# EAGLE design M0_Express_eh_shield (EAGLE 9.1.3)
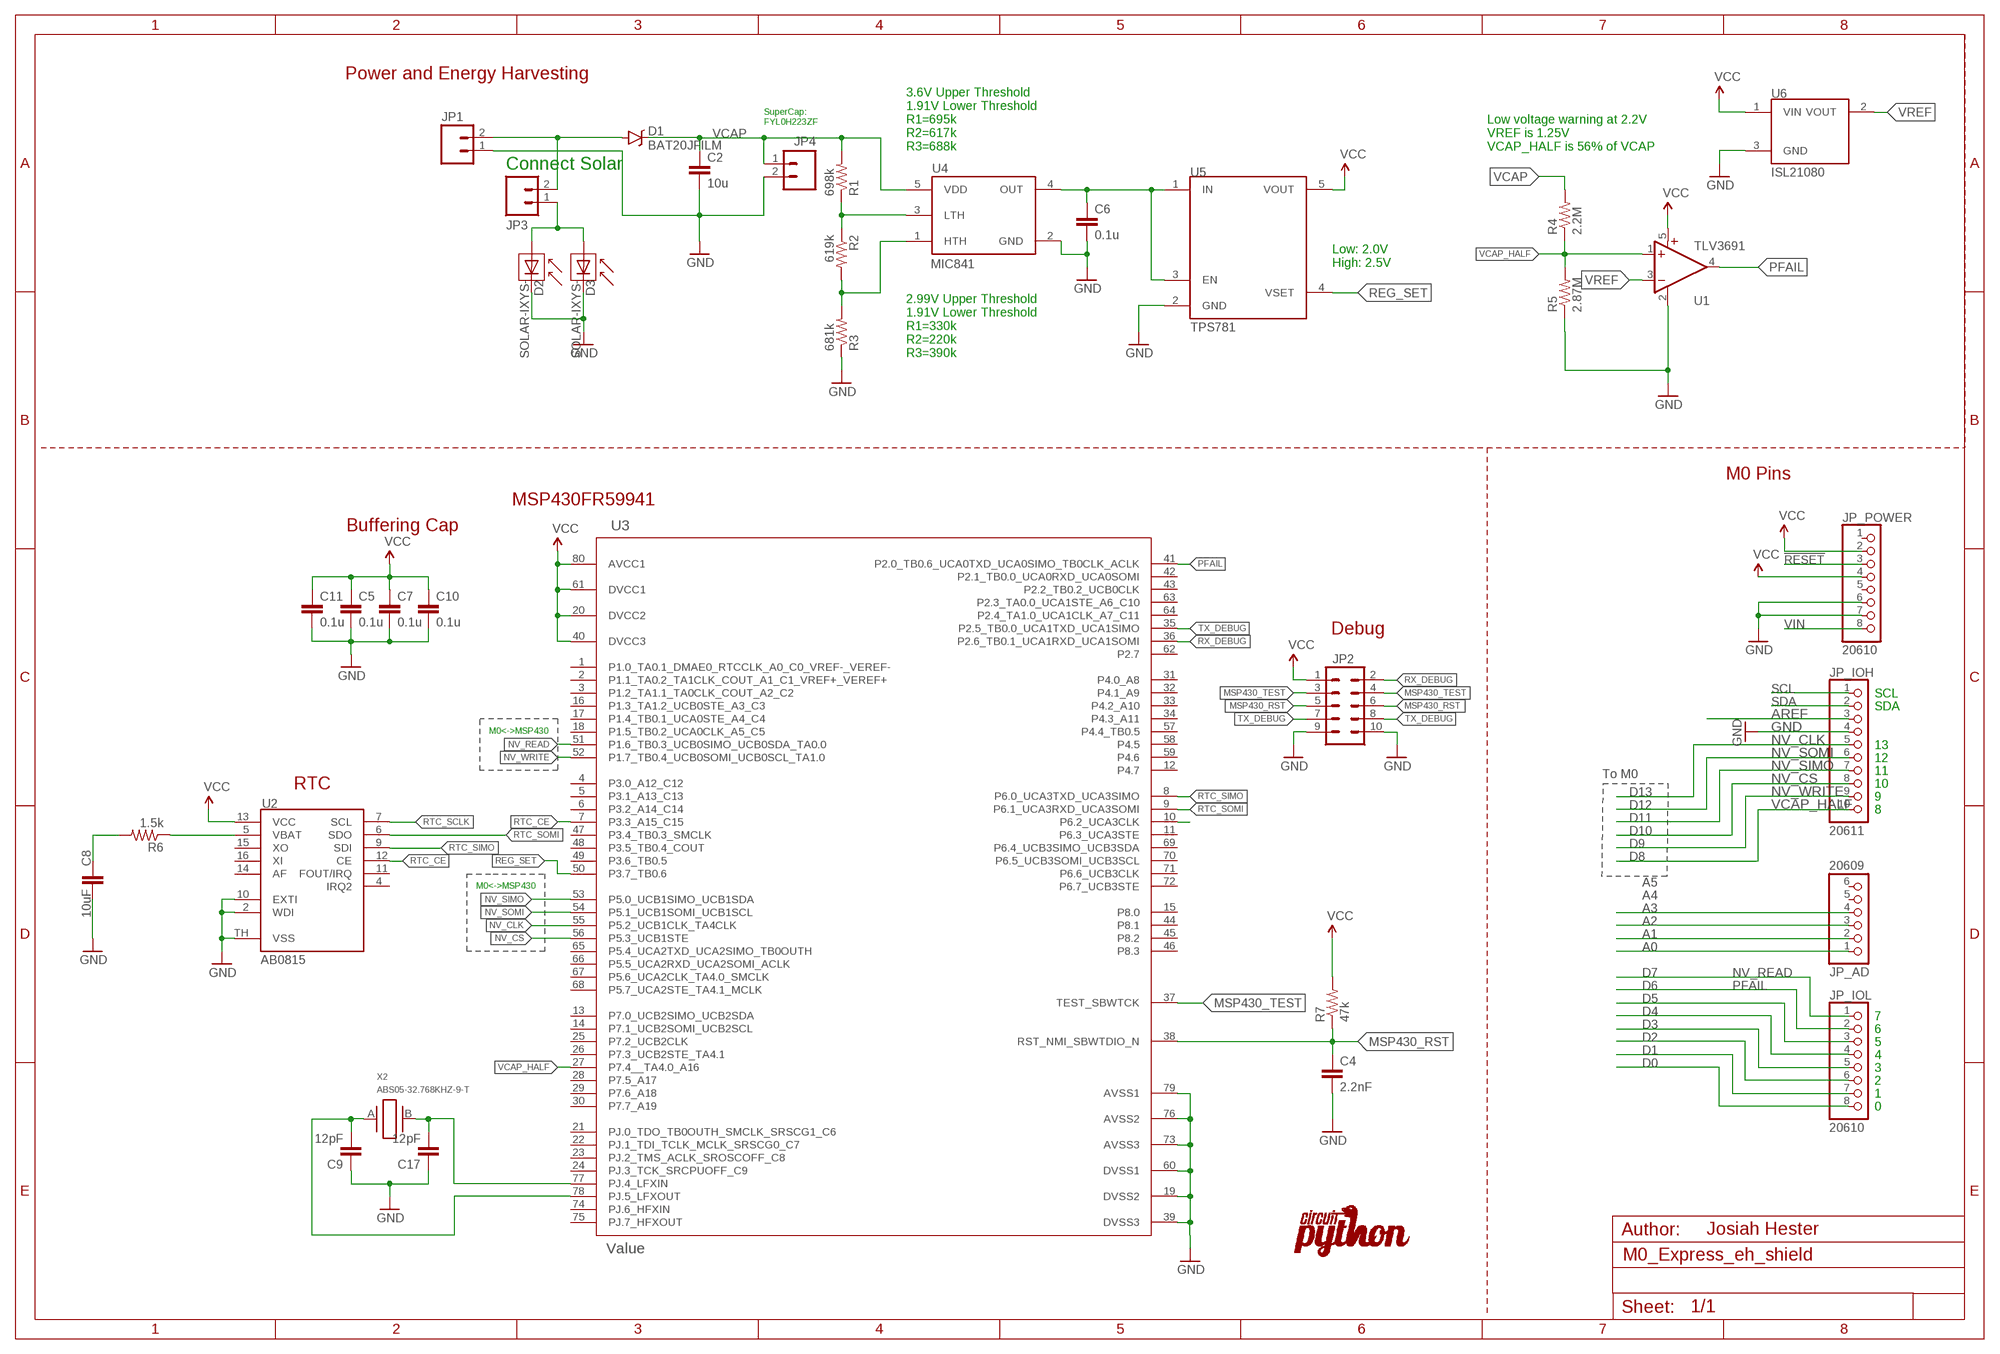
[diagram p0: schematic, sheet 1]

## Parts
C2  10u  CAP0805  [0805]
C4  2.2nF  C-EU0603  [0603]
C5  0.1u  C-EU0603  [0603]
C6  0.1u  C-EU0603  [0603]
C7  0.1u  C-EU0603  [0603]
C8  10uF  CAP0805  [0805]
C9  12pF  C-EU0603  [0603]
C10  0.1u  C-EU0603  [0603]
C11  0.1u  C-EU0603  [0603]
C17  12pF  C-EU0603  [0603]
D1  BAT20JFILM  [SOD-323]
D2  SOLAR-IXYS-  [SOLARBIT-12X1]
D3  SOLAR-IXYS-  [SOLARBIT-12X1]
JP1  M02LOCK  [1X02_LOCK]
JP2  M05X21.27MM  [2X5_1.27MM]
JP3  M02LOCK  [1X02_LOCK]
JP4  M025MM  [SCREWTERMINAL-5MM-2]
JP_AD  20609  HEADER-1X6OVALWAVE  [1X06_OVALWAVE]
JP_IOH  20611  HEADER-1X10OVALWAVE  [1X10_OVALWAVE]
JP_IOL  20610  HEADER-1X8OVALWAVE  [1X08_OVALWAVE]
JP_POWER  20610  HEADER-1X8OVALWAVE  [1X08_OVALWAVE]
R1  698k  R-EU0603  [0603]
R2  619k  R-EU0603  [0603]
R3  681k  R-EU0603  [0603]
R4  2.2M  R-EU0603  [0603]
R5  2.87M  R-EU0603  [0603]
R6  1.5k  R-EU0603  [0603]
R7  47k  R-EU0603  [0603]
U1  TLV3691  [SC70-5]
U2  AB0815  [QFN16]
U3  Value  MSP430FR5994IPNR  [PN0080A_N]
U4  MIC841  [SC70-5]
U5  TPS781  [DCK_R-PDSO-G5]
U6  ISL21080  [SOT-23]
U$1  LOGO  [CIRCUITPYTHON-LOGO]
X2  ABS05-32.768KHZ-9-T  [ABS05]

## Nets
!RESET: JP_POWER.3
A0: JP_AD.1
A1: JP_AD.2
A2: JP_AD.3
A3: JP_AD.4
AREF [aref]: JP_IOH.3
D0: JP_IOL.8
D1: JP_IOL.7
D2: JP_IOL.6
D3: JP_IOL.5
D4: JP_IOL.4
D5: JP_IOL.3
GND [gnd]: C2.2 C4.2 C5.2 C6.2 C7.2 C8.2 C9.1 C10.2 C11.2 C17.1 D2.-(C) D3.-(C) JP1.1 JP2.9 JP2.10 JP4.2 JP_IOH.4 JP_POWER.6 JP_POWER.7 R3.1 R5.1 U1.2(GND) U2.2(WDI) U2.10(EXTI) U2.TH(VSS) U3.19(DVSS2) U3.39(DVSS3) U3.60(DVSS1) U3.73(AVSS3) U3.76(AVSS2) U3.79(AVSS1) U4.2(GND) U5.2(GND) U6.3(GND)
MSP430_RST: C4.1 JP2.5 JP2.6 R7.1 U3.38(RST_NMI_SBWTDIO_N)
MSP430_TEST: JP2.3 JP2.4 U3.37(TEST_SBWTCK)
N$1: D1.A JP1.2 JP3.2
N$2: R1.1 R2.1 U4.3(LTH)
N$3: R2.2 R3.2 U4.1(HTH)
N$4: R6.1 U2.5(VBAT)
N$5: C17.2 U3.77(PJ.4_LFXIN) X2.B
N$6: C9.2 U3.78(PJ.5_LFXOUT) X2.A
N$7: C6.1 U4.4(OUT) U5.1(IN) U5.3(EN)
N$8: C8.1 R6.2
N$10: D2.+(A) D3.+(A) JP3.1
NV_CLK: JP_IOH.5 U3.55(P5.2_UCB1CLK_TA4CLK)
NV_CS: JP_IOH.8 U3.56(P5.3_UCB1STE)
NV_READ: JP_IOL.1 U3.51(P1.6_TB0.3_UCB0SIMO_UCB0SDA_TA0.0)
NV_SIMO: JP_IOH.7 U3.53(P5.0_UCB1SIMO_UCB1SDA)
NV_SOMI: JP_IOH.6 U3.54(P5.1_UCB1SOMI_UCB1SCL)
NV_WRITE: JP_IOH.9 U3.52(P1.7_TB0.4_UCB0SOMI_UCB0SCL_TA1.0)
PFAIL: JP_IOL.2 U1.4(OUT) U3.41(P2.0_TB0.6_UCA0TXD_UCA0SIMO_TB0CLK_ACLK)
REG_SET: U3.50(P3.7_TB0.6) U5.4(VSET)
RTC_CE: U2.12(CE) U3.7(P3.3_A15_C15)
RTC_SCLK: U2.7(SCL) U3.10(P6.2_UCA3CLK)
RTC_SIMO: U2.9(SDI) U3.8(P6.0_UCA3TXD_UCA3SIMO)
RTC_SOMI: U2.6(SDO) U3.9(P6.1_UCA3RXD_UCA3SOMI)
RX_DEBUG: JP2.2 U3.36(P2.6_TB0.1_UCA1RXD_UCA1SOMI)
SCL: JP_IOH.1
SDA: JP_IOH.2
TX_DEBUG: JP2.7 JP2.8 U3.35(P2.5_TB0.0_UCA1TXD_UCA1SIMO)
VCAP: C2.1 D1.C JP4.1 R1.2 R4.2 U4.5(VDD)
VCAP_HALF: JP_IOH.10 R4.1 R5.2 U1.1(+IN) U3.27(P7.4__TA4.0_A16)
VCC: C5.1 C7.1 C10.1 C11.1 JP2.1 JP_POWER.2 JP_POWER.4 R7.2 U1.5(V+) U2.13(VCC) U3.20(DVCC2) U3.40(DVCC3) U3.61(DVCC1) U3.80(AVCC1) U5.5(VOUT) U6.1(VIN)
VIN [USB]: JP_POWER.8
VREF: U1.3(-IN) U6.2(VOUT)
Unconnected: JP_AD.5 JP_AD.6 JP_POWER.1 JP_POWER.5 U2.4(IRQ2) U2.11(FOUT/IRQ) U2.14(AF) U2.15(XO) U2.16(XI) U3.1(P1.0_TA0.1_DMAE0_RTCCLK_A0_C0_VREF-_VEREF-) U3.2(P1.1_TA0.2_TA1CLK_COUT_A1_C1_VREF+_VEREF+) U3.3(P1.2_TA1.1_TA0CLK_COUT_A2_C2) U3.4(P3.0_A12_C12) U3.5(P3.1_A13_C13) U3.6(P3.2_A14_C14) U3.11(P6.3_UCA3STE) U3.12(P4.7) U3.13(P7.0_UCB2SIMO_UCB2SDA) U3.14(P7.1_UCB2SOMI_UCB2SCL) U3.15(P8.0) U3.16(P1.3_TA1.2_UCB0STE_A3_C3) U3.17(P1.4_TB0.1_UCA0STE_A4_C4) U3.18(P1.5_TB0.2_UCA0CLK_A5_C5) U3.21(PJ.0_TDO_TB0OUTH_SMCLK_SRSCG1_C6) U3.22(PJ.1_TDI_TCLK_MCLK_SRSCG0_C7) U3.23(PJ.2_TMS_ACLK_SROSCOFF_C8) U3.24(PJ.3_TCK_SRCPUOFF_C9) U3.25(P7.2_UCB2CLK) U3.26(P7.3_UCB2STE_TA4.1) U3.28(P7.5_A17) U3.29(P7.6_A18) U3.30(P7.7_A19) U3.31(P4.0_A8) U3.32(P4.1_A9) U3.33(P4.2_A10) U3.34(P4.3_A11) U3.42(P2.1_TB0.0_UCA0RXD_UCA0SOMI) U3.43(P2.2_TB0.2_UCB0CLK) U3.44(P8.1) U3.45(P8.2) U3.46(P8.3) U3.47(P3.4_TB0.3_SMCLK) U3.48(P3.5_TB0.4_COUT) U3.49(P3.6_TB0.5) U3.57(P4.4_TB0.5) U3.58(P4.5) U3.59(P4.6) U3.62(P2.7) U3.63(P2.3_TA0.0_UCA1STE_A6_C10) U3.64(P2.4_TA1.0_UCA1CLK_A7_C11) U3.65(P5.4_UCA2TXD_UCA2SIMO_TB0OUTH) U3.66(P5.5_UCA2RXD_UCA2SOMI_ACLK) U3.67(P5.6_UCA2CLK_TA4.0_SMCLK) U3.68(P5.7_UCA2STE_TA4.1_MCLK) U3.69(P6.4_UCB3SIMO_UCB3SDA) U3.70(P6.5_UCB3SOMI_UCB3SCL) U3.71(P6.6_UCB3CLK) U3.72(P6.7_UCB3STE) U3.74(PJ.6_HFXIN) U3.75(PJ.7_HFXOUT)

## Notes on the sheet
- Power and Energy Harvesting
- SuperCap:
  FYL0H223ZF
- 3.6V Upper Threshold
  1.91V Lower Threshold
  R1=695k
  R2=617k
  R3=688k
- Low voltage warning at 2.2V
  VREF is 1.25V
  VCAP_HALF is 56% of VCAP
- Connect Solar
- Low: 2.0V
  High: 2.5V
- 2.99V Upper Threshold
  1.91V Lower Threshold
  R1=330k
  R2=220k
  R3=390k
- M0 Pins
- MSP430FR59941
- Buffering Cap
- Debug
- SCL
- SDA
- M0<->MSP430
- 13
- 12
- 11
- To M0
- RTC | 10
- D13 | 9
- D12 | 8
- D11
- D10
- D9
- D8
- A5
- M0<->MSP430
- A4
- D7
- D6
- 7
- 6
- 5
- 4
- 3
- 2
- 1
- 0
- Josiah Hester

## Library data of the parts
C2 C8 = SparkFun-Capacitors:CAP: Capacitor Standard 0603 ceramic capacitor, and 0.1" leaded capacitor.; DIGIKEY: 1276-6456-1-ND
C4 = tiny_passives:C-EU; DIGIKEY: 478-1219-1-ND; MPN: 06035C222KAT2A
C5-C7 C10 C11 = tiny_passives:C-EU; DIGIKEY: 1276-1005-1-ND; MPN: CL10B104KO8NNNC
C9 C17 = tiny_passives:C-EU; DIGIKEY: 1276-1254-1-ND; MPN: CL10C120JB8NNNC
D1 = SparkFun-DiscreteSemi:BAT20JFILM: 23V, 1A Schottky diode, SOD-323 package; DIGIKEY: NSR0530HT1GOSCT-ND; PROD_ID: DIO-11623
D2 D3 = SparkFun-Sensors:SOLAR-IXYS; DIGIKEY: KXOB25-02X8F-ND; MPN: KXOB25-02X8F
JP1 JP3 = SparkFun-Connectors:M02: Standard 2-pin 0.1" header. Use with - straight break away headers ( PRT-00116) - right angle break away headers (PRT-00553) - swiss pins (PRT-00743) - machine pins (PRT-00117) - female headers (PRT-00115) Molex polarized connector foot print use with: PRT-08233 with associated crimp pins and housings. 2.54_SCREWTERM for use with PRT-10571. 3.5mm Screw Terminal footprints for PRT-08084 5mm Screw Terminal footprints for use with PRT-08432
JP2 = SparkFun-Connectors:M05X2: Header 5x2 Standard 10-pin dual row 0.1" header. Commonly used with AVR-ISP. Use with Spark Fun Electronics SKU: PRT-00778; DIGIKEY: 1175-1627-ND; MPN: 3220-10-0100-00
JP4 = SparkFun-Connectors:M02: Standard 2-pin 0.1" header. Use with - straight break away headers ( PRT-00116) - right angle break away headers (PRT-00553) - swiss pins (PRT-00743) - machine pins (PRT-00117) - female headers (PRT-00115) Molex polarized connector foot print use with: PRT-08233 with associated crimp pins and housings. 2.54_SCREWTERM for use with PRT-10571. 3.5mm Screw Terminal footprints for PRT-08084 5mm Screw Terminal footprints for use with PRT-08432; STOREFRONT_ID: PRT-08432
JP_AD = microbuilder:HEADER-1X6: PIN HEADER
JP_IOH = microbuilder:HEADER-1X10: PIN HEADER
JP_IOL JP_POWER = microbuilder:HEADER-1X8: PIN HEADER
R1 = tiny_passives:R-EU; DIGIKEY: 311-698KHRCT-ND; MPN: RC0603FR-07698KL
R2 = tiny_passives:R-EU; DIGIKEY: 311-619KHRCT-ND; MPN: RC0603FR-07619KL
R3 = tiny_passives:R-EU; DIGIKEY: RMCF0603FT681KCT-ND; MPN: RMCF0603FT681K
R4 = tiny_passives:R-EU; DIGIKEY: YAG3329CT-ND; MPN: RC0603FR-072M2L
R5 = tiny_passives:R-EU; DIGIKEY: RMCF0603FT2M87CT-ND; MPN: RMCF0603FT2M87
R6 = tiny_passives:R-EU; DIGIKEY: A121524CT-ND; MPN: CRG0603F1K5
R7 = tiny_passives:R-EU; DIGIKEY: 541-4061-1-ND; MPN: CRCW060347K0JNEAC
U1 = tlv3691:TLV3691: 0.9-V to 6.5-V, Nanopower Comparator Datasheets Analog Signal Chain Guide <http://www.ti.com/lit/pdf/slyb174> TLV3691 <http://www.ti.com/lit/ds/symlink/tlv3691.pdf> Manufacturer Product Page TLV3691IDPFR Specifications <http://www.ti.com/general/docs/suppproductinfo.tsp?distId=10&orderablePartNumber=TLV3691IDPFR> Standard Package <javascript:dlgHelp('Standard%20Packaging%20Help');> 1 Category Integrated Circuits (ICs) </product-search/en/integrated-circuits-ics> Family Linear - Comparators </product-search/en/integrated-circuits-ics/linear-comparators/2556221> Series - Packaging <javascript:dlgHelp('Standard%20Packaging%20Help');> Cut Tape (CT) <javascript:dlgHelp('Cut%20Tape%20Help');> Type General Purpose Number of Elements 1 Output Type Push-Pull Voltage - Supply, Single/Dual (±) 0.9 V ~ 6.5 V, ±0.45 V ~ 3.25 V Voltage - Input Offset (Max) 3mV Current - Input Bias (Max) 100pA Current - Output (Typ) 42mA Current - Quiescent (Max) 150nA CMRR, PSRR (Typ) - Propagation Delay (Max) 35µs Hysteresis - Operating Temperature -40°C ~ 125°C Package / Case 6-XFDFN Mounting Type Surface Mount Supplier Device Package 6-X2SON (1x1) Online Catalog Comparators - 1 element </catalog/en/partgroup/comparators-1-element/3112?mpart=TLV3691IDPFR&vendor=296&WT.z_ref_page_type=PS&WT.z_ref_page_sub_type=PD&WT.z_ref_page_id=PD&WT.z_ref_page_event=DC_Link_Table> Other Names 296-37242-1; DIGIKEY: 296-37910-1-ND; MPN: TLV3691IDCKR
U2 = AB08XX:AB0815: AB08X5 Real-Time Clock Family: SPI The ABRACON AB08X5 Real-Time Clock family provides a groundbreaking combination of ultra-low power coupled with a highly sophisticated feature set. With power requirements significantly lower than any other industry RTC (as low as 14 nA), these are the first semiconductors based on innovative SPOTTM (Subthreshold Power Optimized Technology) CMOS platform. The AB08X5 includes on-chip oscillators to provide minimum power consumption, full RTC functions including battery backup and programmable counters and alarms for timer and watchdog functions, and either an I2C or SPI serial interface for communication with a host controller.; DIGIKEY: 535-11930-1-ND; MPN: AB0815-T3
U3 = msp430fr5994:MSP430FR5994IPNR; DIGIKEY: 296-45561-1-ND; MANUFACTURER: Texas Instruments; PARTNUMBER: MSP430FR5994IPNR; REFDES: RefDes; TYPE: TYPE
U4 = fedpower:MIC841: MIC841:Comparator with reference and adj. hysteresis; DIGIKEY: 576-2923-1-ND; MPN: MIC841HYC5-TR
U5 = ti-regulator:TPS781: Texas Instruments: TPS781 150mA, Low-Dropout Regulator, Ultralow-Power, IQ 1µA with Pin-Selectable, Dual-Level Output Voltage; DIGIKEY: 296-29966-1-ND
U6 = isl21080:ISL21080: Intersil: ISL21080, 300nA NanoPower Voltage References The ISL21080 analog voltage references feature low supply voltage operation at ultra-low 310nA typ, 1.5µA max operating current. Additionally, the ISL21080 family features guaranteed initial accuracy as low as ±0.2% and 50ppm/°C temperature coefficient. These references are ideal for general purpose portable applications to extend battery life at lower cost. The ISL21080 is provided in the industry standard 3 Ld SOT-23 pinout. The ISL21080 output voltages can be used as precision voltage sources for voltage monitors, control loops, standby voltages for low power states for DSP, FPGA, Datapath Controllers, microcontrollers and other core voltages: 0.9V, 1.024V, 1.25V, 1.5V, 2.048V, 2.5V, 3.0V, 3.3V, 4.096V and 5.0V. Special Note: Post-assembly x-ray inspection may lead to permanent changes in device output voltage and should be minimized or avoided. For further information, please see “Applications Information” on page 14 and AN1533, “X-Ray Effects on Intersil FGA References”.; DIGIKEY: ISL21080DIH312Z-TKTR-ND; MPN: ISL21080DIH312Z-TK
U$1 = circuitpython-logo:LOGO
X2 = abs05:ABS05-32.768KHZ: 32.768kHz Crystal; DIGIKEY: 535-11897-1-ND; MPN: ABS05-32.768KHZ-9-T

## Net classes
0 default: width 0.33 mm, drill 0.33 mm, clearance 0.152 mm

## Board
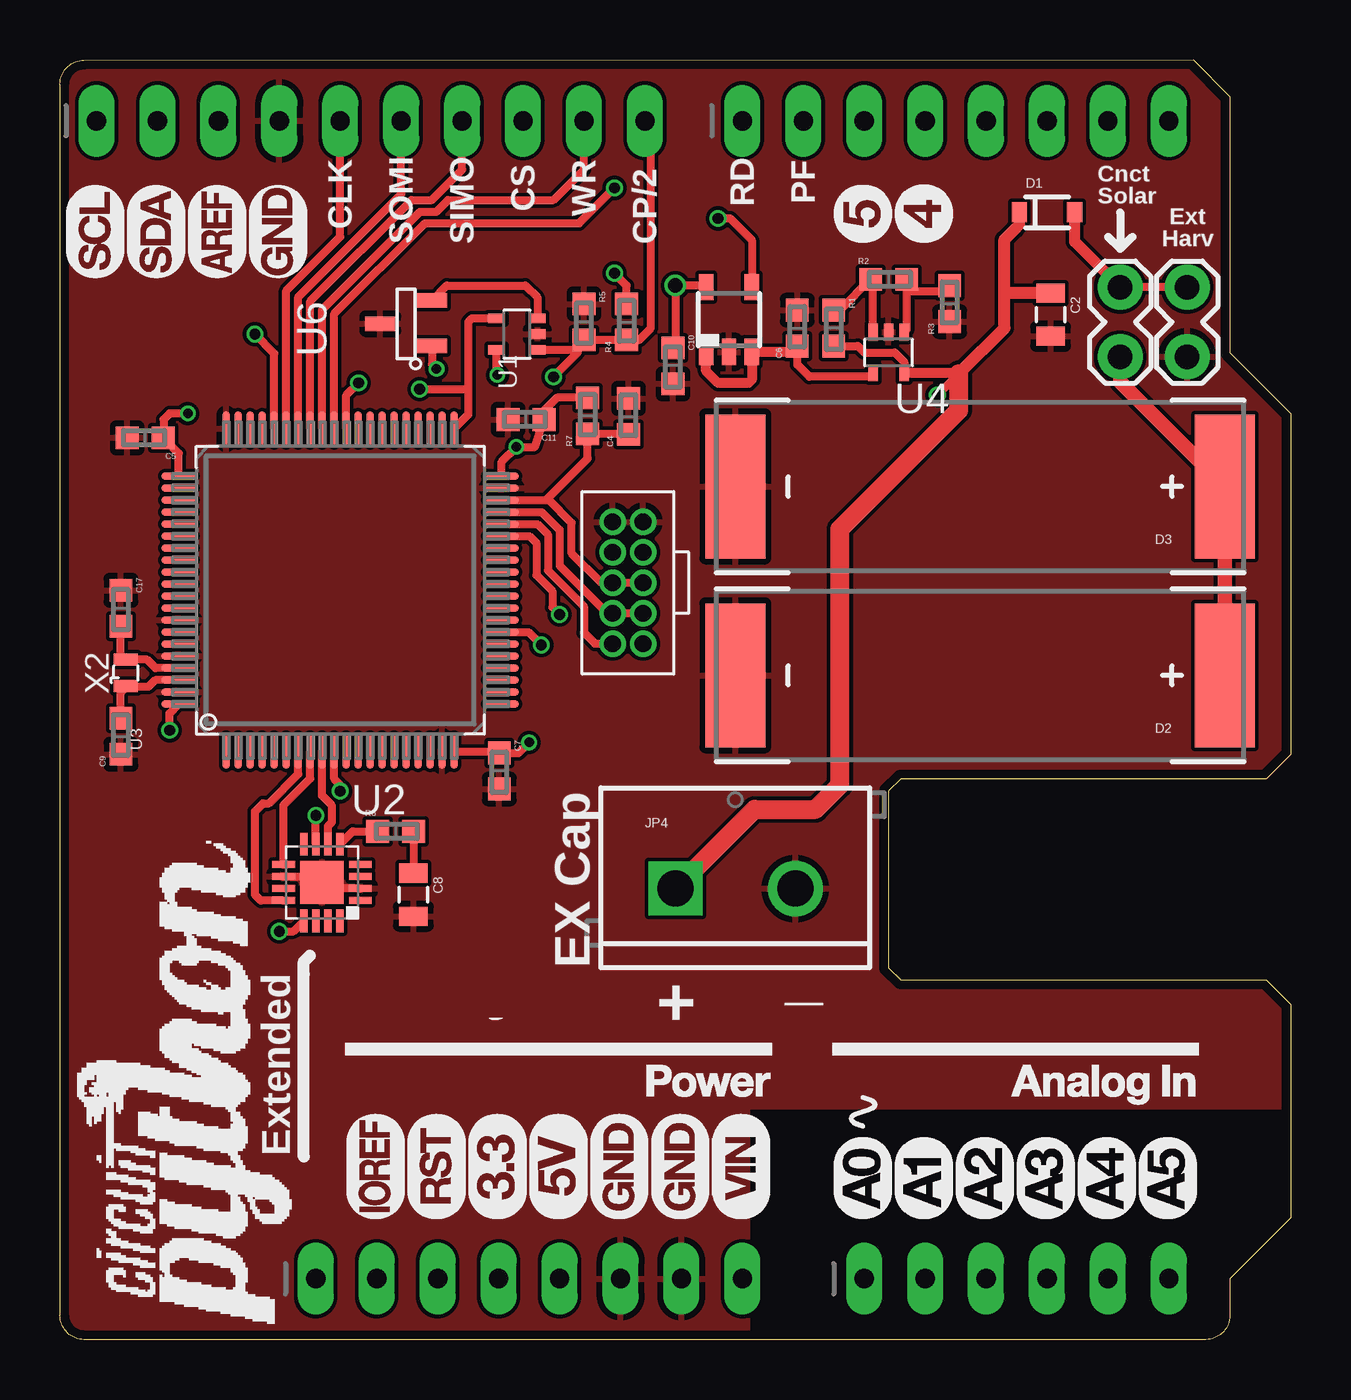
[diagram p1: board, top side]
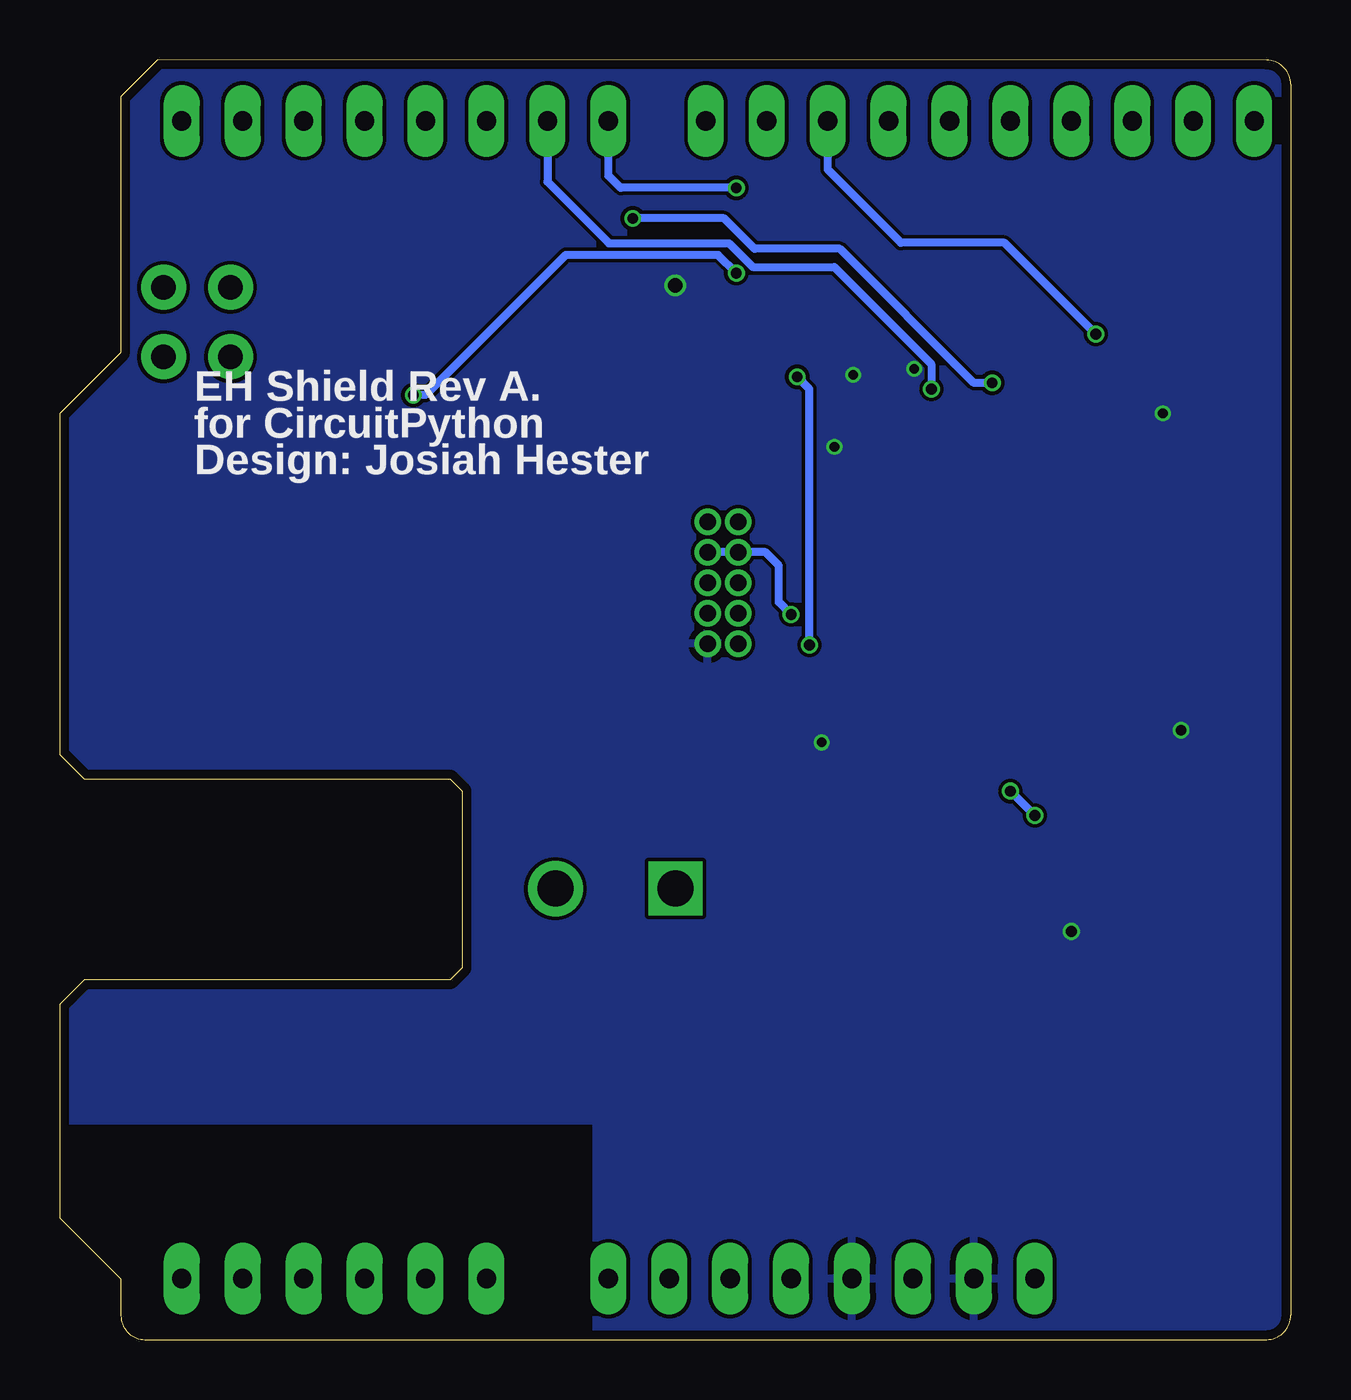
[diagram p2: board, bottom side, seen from below]

Size 51.31 x 53.34 mm. Coordinates in mm from the lower left corner, seen from the top.
Outline: 47.24,53.34 48.77,51.82 48.77,41.15 51.31,38.61 51.31,24.38 50.29,23.37 35.05,23.37 34.54,22.86 34.54,15.75 34.54,15.49 35.05,14.99 50.04,14.99 50.29,14.99 51.31,13.97 51.31,13.72 51.31,5.08 48.77,2.54 48.77,1 arc-90 47.77,0 1,0 arc-90 0,1.02 0,52.32 arc-90 1,53.32 47.24,53.34
Copper layers (1*16): Top 0.035559375mm / dielectric 1.6mm / Bottom 0.035559375mm
Design rules "oshpark-2layer": minimum track width 6mil, minimum drill 10mil, track to track 6mil, track to pad 6mil, pad to pad 6mil, via to via 6mil, smd to smd 6mil, copper to edge 15mil, drill to drill 6mil, minimum pad ring 5mil, minimum via ring 5mil, stop-mask expansion 2.5mil, vias tented up to drill 0mil, thermal gap 10mil

### Footprints (pad centres in the part's own frame; a part is rotated, then mirrored left to right if it is on the bottom)
0805 = smd 0.8 x 1.2: 1 -0.9,0; 2 0.9,0
0603 = smd 0.95 x 0.95: 1 -0.75,0; 2 0.75,0
SOD-323 = smd 0.63 x 0.83: A 1.15,0; C -1.15,0
SOLARBIT-12X1 = smd 2.5 x 6: + -10.2,0; - 10.2,0
1X02_LOCK = drill 1.016 pad 1.88: 1 -0.178,0; 2 2.718,0
2X5_1.27MM = drill 0.7 pad 1.1: 1 0,0; 2 1.27,0; 3 0,-1.27; 4 1.27,-1.27; 5 0,-2.54; 6 1.27,-2.54; 7 0,-3.81; 8 1.27,-3.81; 9 0,-5.08; 10 1.27,-5.08
SCREWTERMINAL-5MM-2 = drill 1.5 pad 2.232 square: 1 0,0 | drill 1.5 pad 2.3: 2 5,0
1X06_OVALWAVE = drill 0.8 pad 1.5 long: 1 -6.35,0; 2 -3.81,0; 3 -1.27,0; 4 1.27,0; 5 3.81,0; 6 6.35,0
1X10_OVALWAVE = drill 0.8 pad 1.5 long: 1 -11.43,0; 2 -8.89,0; 3 -6.35,0; 4 -3.81,0; 5 -1.27,0; 6 1.27,0; 7 3.81,0; 8 6.35,0; 9 8.89,0; 10 11.43,0
1X08_OVALWAVE = drill 0.8 pad 1.5 long: 1 -8.89,0; 2 -6.35,0; 3 -3.81,0; 4 -1.27,0; 5 1.27,0; 6 3.81,0; 7 6.35,0; 8 8.89,0
SC70-5 = smd 0.4 x 0.7: 1 -0.65,-0.85; 2 0,-0.85; 3 0.65,-0.85; 4 0.65,0.85; 5 -0.65,0.85
QFN16 = smd 0.95 x 0.3: 1 -1.6,0.75; 2 -1.6,0.25; 3 -1.6,-0.25; 4 -1.6,-0.75; 9 1.6,-0.75; 10 1.6,-0.25; 11 1.6,0.25; 12 1.6,0.75 | smd 0.3 x 0.95: 5 -0.75,-1.6; 6 -0.25,-1.6; 7 0.25,-1.6; 8 0.75,-1.6; 13 0.75,1.6; 14 0.25,1.6; 15 -0.25,1.6; 16 -0.75,1.6 | smd 1.8 x 1.8: TH 0,0
PN0080A_N = smd 1.448 x 0.305: 1 -6.725,4.75; 2 -6.725,4.25; 3 -6.725,3.75; 4 -6.725,3.25; 5 -6.725,2.75; 6 -6.725,2.25; 7 -6.725,1.75; 8 -6.725,1.25; 9 -6.725,0.75; 10 -6.725,0.25; 11 -6.725,-0.25; 12 -6.725,-0.75; 13 -6.725,-1.25; 14 -6.725,-1.75; 15 -6.725,-2.25; 16 -6.725,-2.75; 17 -6.725,-3.25; 18 -6.725,-3.75; 19 -6.725,-4.25; 20 -6.725,-4.75; 41 6.725,-4.75; 42 6.725,-4.25; 43 6.725,-3.75; 44 6.725,-3.25; 45 6.725,-2.75; 46 6.725,-2.25; 47 6.725,-1.75; 48 6.725,-1.25; 49 6.725,-0.75; 50 6.725,-0.25; 51 6.725,0.25; 52 6.725,0.75; 53 6.725,1.25; 54 6.725,1.75; 55 6.725,2.25; 56 6.725,2.75; 57 6.725,3.25; 58 6.725,3.75; 59 6.725,4.25; 60 6.725,4.75 | smd 0.305 x 1.448: 21 -4.75,-6.725; 22 -4.25,-6.725; 23 -3.75,-6.725; 24 -3.25,-6.725; 25 -2.75,-6.725; 26 -2.25,-6.725; 27 -1.75,-6.725; 28 -1.25,-6.725; 29 -0.75,-6.725; 30 -0.25,-6.725; 31 0.25,-6.725; 32 0.75,-6.725; 33 1.25,-6.725; 34 1.75,-6.725; 35 2.25,-6.725; 36 2.75,-6.725; 37 3.25,-6.725; 38 3.75,-6.725; 39 4.25,-6.725; 40 4.75,-6.725; 61 4.75,6.725; 62 4.25,6.725; 63 3.75,6.725; 64 3.25,6.725; 65 2.75,6.725; 66 2.25,6.725; 67 1.75,6.725; 68 1.25,6.725; 69 0.75,6.725; 70 0.25,6.725; 71 -0.25,6.725; 72 -0.75,6.725; 73 -1.25,6.725; 74 -1.75,6.725; 75 -2.25,6.725; 76 -2.75,6.725; 77 -3.25,6.725; 78 -3.75,6.725; 79 -4.25,6.725; 80 -4.75,6.725
DCK_R-PDSO-G5 = smd 0.6 x 1.1: 1 -0.95,-1.35; 2 0,-1.35; 3 0.95,-1.35; 4 0.95,1.35; 5 -0.95,1.35
SOT-23 = smd 0.6 x 1.25: 1 -0.95,-1.075; 2 0.95,-1.075; 3 -0.025,1.075
ABS05 = smd 0.5 x 1: A -0.55,0; B 0.55,0

### Placement (x,y rotation side)
C2  41.3,42.72 270 top
C4  23.7,38.48 90 top
C5  3.56,37.59 180 top
C6  30.73,42.16 90 top
C7  18.31,23.7 270 top
C8  14.73,18.54 270 top
C9  2.54,25.15 90 top
C10  25.55,40.59 270 top
C11  19.43,38.35 180 top
C17  2.54,30.48 270 top
D1  41.15,46.99 0 top
D2  38.35,27.69 180 top
D3  38.35,35.56 180 top
JP1  46.99,41.15 90 top
JP2  24.31,29.01 180 top
JP3  44.2,41.15 90 top
JP4  25.65,18.8 0 top
JP_AD  39.88,2.54 0 top
JP_IOH  12.95,50.8 0 top
JP_IOL  37.34,50.8 0 top
JP_POWER  19.56,2.54 0 top
R1  32.26,42.16 270 top
R2  34.54,44.2 0 top
R3  37.08,43.18 90 top
R4  23.62,42.42 90 top
R5  21.84,42.42 270 top
R6  14,21.18 0 top
R7  22,38.51 90 top
U1  19.05,41.91 90 top
U2  10.92,19.05 180 top
U3  11.68,31.24 90 top
U4  34.54,41.15 180 top
U5  27.89,42.52 0 top
U6  14.43,42.37 90 top
U$1  10.41,0.51 90 top
X2  2.74,27.79 90 top

### Tracks (layer width: path | path; a pad name or v marks a point on that pad's centre or on a via)
GND
  Top 0.33: U2.10 10.67,19.3 U2.TH 11.18,18.8 11.43,18.8 U2.2
  pour Top: -0.25,53.59 53.85,53.59 53.85,11.68 51.82,9.65 28.7,9.65 28.7,-0.76 -1.27,-0.76 -1.27,53.59
MSP430_RST
  Top 0.33: U3.38 20.26,34.99 | 20.26,34.99 22,36.73 R7.1 23.67,37.76 C4.1 | 20.26,34.99 20.38,34.99 21.34,34.04 21.34,32.77 22.55,31.55 JP2.6 JP2.5
MSP430_TEST
  Top 0.33: JP2.3 JP2.4 22.81,30.28 20.83,32.26 20.83,33.75 20.08,34.49 U3.37
N$1
  Top 0.33: JP1.2 JP3.2
  Top 0.45: JP3.2 42.3,45.76 D1.A
N$2
  Top 0.34: R1.1 32.51,42.91 R2.1 33.89,44.1 U4.3
N$3
  Top 0.34: R3.2 36.84,43.69 35.31,43.69 | U4.1 35.31,42.11 35.31,43.69 | 35.31,43.69 R2.2
N$4
  Top 0.33: U2.5 12.21,21.18 R6.1
N$5
  Top 0.33: U3.77 3.99,27.99 3.63,28.35 2.75,28.35 X2.B 2.54,28.54 C17.2
N$6
  Top 0.33: U3.78 3.97,27.49 3.68,27.2 2.78,27.2 | 2.78,27.2 X2.A | C9.2 2.54,26.97 2.78,27.2
N$7
  Top 0.33: U4.4 33.73,40.13 31.24,40.13 30.73,40.64 C6.1
  Top 0.406: C6.1 30.49,41.17 U5.3 28.84,40.02 28.7,39.88 27.43,39.88 26.94,40.37 U5.1
N$8
  Top 0.33: R6.2 14.73,21.17 C8.1
N$10
  Top 0.61: JP3.1 44.2,39.92 D3.+ D2.+
NV_CLK
  Top 0.33: U3.55 9.43,43.72 11.68,45.97 JP_IOH.5
NV_CS  (via drill 0.45)
  Top 0.33: U3.56 8.93,41.1 v8.13,41.91
  Bottom 0.33: v8.13,41.91 11.94,45.72 16.26,45.72 19.3,48.77 JP_IOH.8
NV_READ  (via drill 0.45)
  Top 0.33: U3.51 11.43,42.76 15.21,46.53 21.64,46.53 v23.11,48.01
  Bottom 0.33: v23.11,48.01 27.94,48.01 28.45,48.51 JP_IOL.1
NV_SIMO
  Top 0.33: U3.53 10.43,43.28 14.65,47.5 15.49,47.5 16.76,48.77 JP_IOH.7
NV_SOMI
  Top 0.33: U3.54 9.93,43.46 14.22,47.75 JP_IOH.6
NV_WRITE
  Top 0.33: U3.52 10.93,42.94 15.01,47.02 15.69,47.02 16.18,47.5 20.57,47.5 21.84,48.77 JP_IOH.9
PFAIL  (via drill 0.45)
  Top 0.33: U1.4 17.16,42.56 17.02,42.42 17.02,39.62 | U3.41 17.02,38.55 17.02,39.62 | v14.99,39.62 17.02,39.62
  Bottom 0.33: JP_IOL.2 30.99,48.26 28.42,45.7 23.41,45.7 22.42,44.7 19.03,44.7 14.99,40.66 v14.99,39.62
REG_SET  (via drill 0.45)
  Top 0.33: U3.50 11.93,39.37 v12.45,39.88 | v27.43,46.74 27.94,46.74 28.84,45.84 U5.4
  Bottom 0.33: v12.45,39.88 13.21,39.88 18.8,45.47 22.35,45.47 23.62,46.74 v27.43,46.74
RTC_CE
  Top 0.33: U2.12 8.37,18.3 8.13,18.54 8.13,22.02 8.46,22.35 8.72,22.35 9.93,23.57 U3.7
RTC_SCLK  (via drill 0.45)
  Top 0.33: U2.7 v10.67,21.84 | v11.68,22.86 11.68,23.11 11.43,23.37 U3.10
  Bottom 0.33: v10.67,21.84 v11.68,22.86
RTC_SIMO
  Top 0.33: U2.9 9.32,22.28 10.43,23.39 U3.8
RTC_SOMI
  Top 0.33: U2.6 11.17,21.4 11.34,21.57 11.34,22.26 10.92,22.68 10.92,24.51 U3.9
RX_DEBUG
  Top 0.33: U3.36 19.9,33.99 20.34,33.55 20.34,32.06 21.84,30.56 21.84,29.46 22.3,29.01 JP2.2
TX_DEBUG  (via drill 0.45)
  Top 0.33: v20.83,30.23 20.53,30.53 20.53,31.2 19.86,31.86 19.86,33.2 19.57,33.49 U3.35
  Bottom 0.33: v20.83,30.23 21.34,30.73 21.34,32.26 21.89,32.82 JP2.8 JP2.7
VCAP  (via drill 0.45)
  Top 0.33: R1.2 33.26,41.41 33.53,41.15 34.8,41.15 35.19,40.75 U4.5 | R4.2 23.62,43.94 v23.11,44.45 | v36.58,39.37 37.47,40.26 37.5,40.3 | D1.C 40,46.48
  Top 0.406: U4.5 37.5,40.3
  Top 0.45: 40,46.48 39.81,46.29 39.55,46.04
  Top 0.5: 37.5,40.3 39.37,42.16 39.37,43.69 | 39.37,43.69 39.37,45.85 39.81,46.29 | C2.1 39.44,43.62 39.37,43.69
  Top 0.8: JP4.1 28.96,22.1 31.5,22.1 32.51,23.11 32.51,33.78 37.47,38.73 37.47,40.26
  Bottom 0.33: v36.58,39.37 36.07,39.37 30.23,45.21 23.88,45.21 v23.11,44.45
VCAP_HALF  (via drill 0.45)
  Top 0.33: U1.1 21.44,41.26 21.58,41.41 | 21.58,41.41 R5.2 R4.1 24.14,41.67 24.64,42.16 24.64,50.55 JP_IOH.10 | U3.27 19.53,29.49 v20.07,28.96 | v20.57,40.13 21.58,41.14 21.58,41.41
  Bottom 0.33: v20.07,28.96 20.07,39.62 v20.57,40.13
VCC  (via drill 0.4, 0.45, 0.6)
  Top 0.33: U5.5 26.87,43.94 v25.65,43.94 25.65,41.44 C10.1 | v18.24,40.21 18.2,40.24 U1.5 | U6.1 15.5,40.66 v15.7,40.46 | R7.2 20.71,39.26 20.18,38.72 C11.1 19.8,37.21 v19.02,37.21 18.41,36.59 U3.40 | U3.61 4.96,36.94 4.44,37.46 | 4.44,37.46 C5.1 | v5.33,38.61 4.57,38.61 4.32,38.35 4.32,37.58 4.44,37.46 | U3.20 18.24,24.52 C7.1 19.11,24.45 v19.56,24.89 | v4.57,25.4 4.57,26.11 U3.80 | v9.14,17.02 9.74,17.02 U2.13
  pour Bottom: -0.76,54.36 52.07,54.36 52.07,9.14 28.96,9.14 28.96,-0.76 -0.25,-0.76 -0.76,-0.76
VREF
  Top 0.33: U6.2 16.13,43.94 19.41,43.94 19.9,43.45 U1.3

### Text on the board
tPlace: CS | WR | RD | PF | CLK | SOMI | SIMO | CP/2 | Cnct / Solar | Ext / Harv | EX Cap | _ | + | Extended
bPlace: EH Shield Rev A. / for CircuitPython / Design: Josiah Hester
214bmp: D:/SmartProjects/Snc/a4_bn_logo2.bmp